# Altium schematic sheet Battery Board.SchDoc
size A4; SheetNumber: 1; SheetTotal: 2
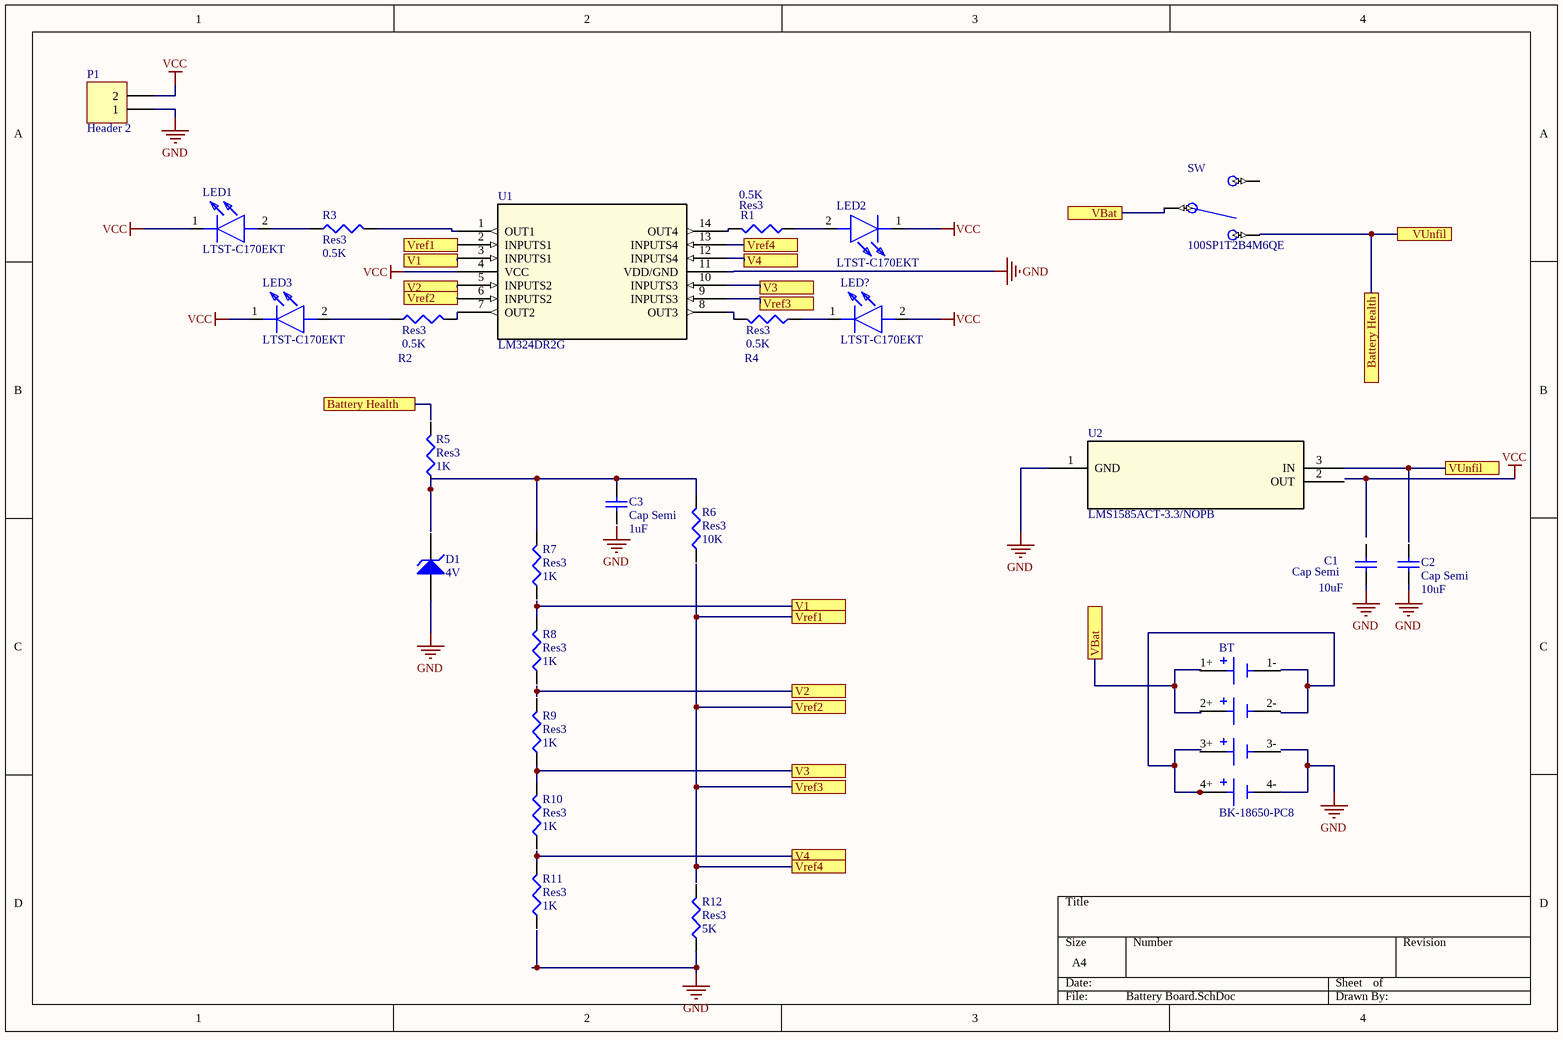
[diagram p0: Battery Board.SchDoc]

## Parts
BT  BK-18650-PC8  [BAT_BK-18650-PC8]
C1  Cap Semi  value 10uF  [C1206]
C2  Cap Semi  value 10uF  [C1206]
C3  Cap Semi  value 1uF  [C1206]
D1  4V  [DIODE-0.7]
LED1  LTST-C170EKT  [LEDC2012X120N]
LED2  LTST-C170EKT  [LEDC2012X120N]
LED3  LTST-C170EKT  [LEDC2012X120N]
LED?  LTST-C170EKT  [LEDC2012X120N]
P1  Header 2  [HDR1X2]
R1  Res3  value 0.5K  [J1-0603]
R2  Res3  value 0.5K  [J1-0603]
R3  Res3  value 0.5K  [J1-0603]
R4  Res3  value 0.5K  [J1-0603]
R5  Res3  value 1K  [J1-0603]
R6  Res3  value 10K  [J1-0603]
R7  Res3  value 1K  [J1-0603]
R8  Res3  value 1K  [J1-0603]
R9  Res3  value 1K  [J1-0603]
R10  Res3  value 1K  [J1-0603]
R11  Res3  value 1K  [J1-0603]
R12  Res3  value 5K  [J1-0603]
SW  100SP1T2B4M6QE  [TOGGLE_RA]
U1  LM324DR2G  [SOIC-14_NB_ONS]
U2  LMS1585ACT-3.3/NOPB  [T03B_TEX]

## Ports
Battery Health, V1, V2, V3, V4, VBat, Vref1, Vref2, Vref3, Vref4, VUnfil

## Nets
GND: BT.4- C1.2 C2.2 D1.1(A) P1.1 R12.1 U1.11(VDD/GND) U2.1(GND)
VCC: LED1.1(K) LED2.1(K) LED3.1(K) LED?.2(A) P1.2 U1.4(VCC)
Battery Health: U2.3(IN) ; port VUnfil, port Battery Health
V1: R8.2 U1.3(INPUTS1) ; port V1
V2: U1.5(INPUTS2) ; port V2
V3: R9.1 R10.2 U1.10(INPUTS3) ; port V3
V4: R11.2 U1.12(INPUTS4) ; port V4
Vref1: U1.2(INPUTS1) U1.6(INPUTS2) U1.9(INPUTS3) U1.13(INPUTS4) ; port Vref1, port Vref2, port Vref3, port Vref4
NetC3_2: C3.2 R5.1 R6.2 R7.2
NetLED1_2: LED1.2(A) R3.1
NetLED2_2: LED2.2(A) R1.1
NetLED3_2: LED3.2(A) R2.1
NetLED?_1: LED?.1(K) R4.1
NetR1_2: R1.2 U1.14(OUT4)
NetR2_2: R2.2 U1.7(OUT2)
NetR3_2: R3.2 U1.1(OUT1)
NetR4_2: R4.2 U1.8(OUT3)

Not connected (* = marked no-connect by the designer): BT 1+ 1- 2+ 2- 3+ 3- 4+; C1 1; C2 1; C3 1; D1 2(K); R5 2; R6 1; R7 1; R8 1; R9 2; R10 1; R11 1; R12 2; SW 1(P$2) 2(COM) 3(P$3); U2 2(OUT)

## Notes on the sheet
- Labels drawn without touching a wire or pin: GND

## Library data of the parts
BT = BK-18650-PC8: Battery Holder _Open_ 18650 4 Cell PC Pin; MF: MPD; MP: BK-18650-PC8; Availability: Unavailable; SnapEDA_Link: https://www.snapeda.com/parts/BK-18650-PC8/MPD%20%28Memory%20Protection%20Devices%29/view-part/51231/?ref=snap; Package: None; Price: None; Value: *
C1-C3 = Cap Semi: Capacitor (Semiconductor SIM Model); Published: 8-Jun-2000; LatestRevisionDate: 29-May-2009; LatestRevisionNote: IPC-7351 Footprint Added.; PackageReference: C1206; Publisher: Altium Limited; PackageDescription: Chip Capacitor
D1 = D Zener: Zener Diode; Published: 8-Jun-2000; LatestRevisionDate: 17-Jul-2002; LatestRevisionNote: Re-released for DXP Platform.; PackageReference: DIODE-0.7; Publisher: Altium Limited; PackageDescription: Diode, Thru-Hole; 2 Leads; 0.7 in Pin Spacing
LED1-LED3 LED? = LTST-C170EKT: LED; Manufacturer_Name: Lite-On; Datasheet Link: https://media.digikey.com/pdf/Data%20Sheets/Lite-On%20PDFs/LTST-C170EKT.pdf; Height: 1.2mm; Manufacturer_Part_Number: LTST-C170EKT; Mouser Part Number: 859-LTST-C170EKT; Mouser Price/Stock: https://www.mouser.co.uk/ProductDetail/Lite-On/LTST-C170EKT?qs=0hBTvMLoVZ04yIRvO1DUlw%3D%3D; Arrow Part Number: LTST-C170EKT; Arrow Price/Stock: https://www.arrow.com/en/products/ltst-c170ekt/lite-on-technology
P1 = Header 2: Header, 2-Pin; LatestRevisionDate: 17-Jul-2002; LatestRevisionNote: Re-released for DXP Platform.; Publisher: Altium Limited
R1-R12 = Res3: Resistor; Published: 8-Jun-2000; LatestRevisionDate: 29-May-2009; LatestRevisionNote: IPC-7351 Footprint Added.; PackageReference: J1-0603; Publisher: Altium Limited; PackageDescription: Chip Resistor
SW = 100SP1T2B4M6QE: Toggle Switch SPDT Through Hole, Right Angle; MF: E-Switch; Value: *; Package: None; Price: None; MP: 100SP1T2B4M6QE; Availability: Unavailable; SnapEDA_Link: https://www.snapeda.com/parts/100SP1T2B4M6QE/E-Switch/view-part/584067/?ref=snap
U1 = LM324DR2G: No Description Available; Mfr_Name: onsemi; Copyright: Copyright (C) 2022 Ultra Librarian. All rights reserved.; Manufacturer_Part_Number: LM324DR2G; Digi-Key_Part_Number_1: 2156-LM324DR2G-OS-ND; Digi-Key_Part_Number_2: =LM324DR2G; Digi-Key_Part_Number_3: LM324DR2GOSCT-ND; Digi-Key_Part_Number_4: LM324DR2GOSDKR-ND; Digi-Key_Part_Number_5: LM324DR2GOSTR-ND; RefDes: RefDes; Type: DEV
U2 = LMS1585ACT-3.3/NOPB: No Description Available; Mfr_Name: Texas Instruments; Copyright: Copyright (C) 2022 Ultra Librarian. All rights reserved.; Manufacturer_Part_Number: LMS1585ACT-3.3/NOPB; Digi-Key_Part_Number_1: LMS1585ACT-3.3/NOPB-ND; RefDes: RefDes; Type: DEV